# EAGLE board BusPirate-ultra.v1.0b (EAGLE 9.1.3)
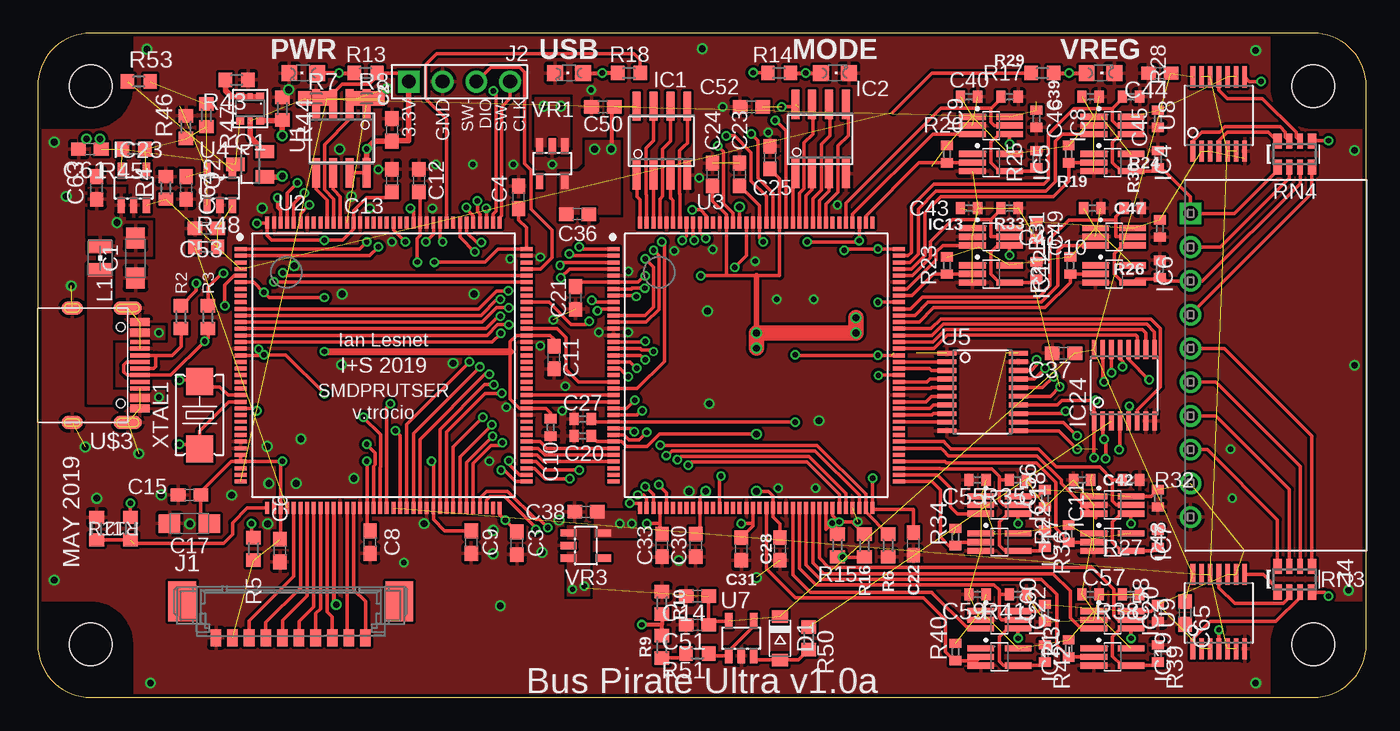
[diagram p2: board, top side]
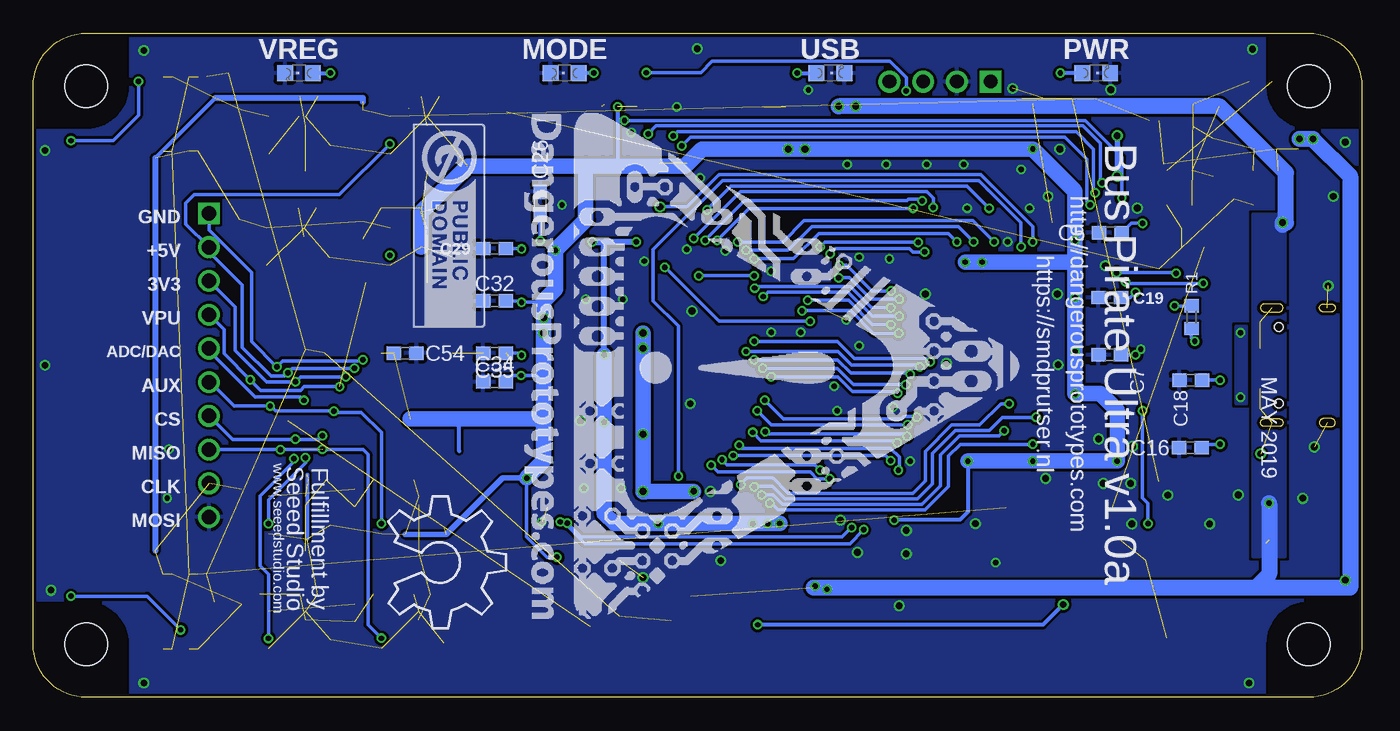
[diagram p3: board, bottom side, seen from below]

Size 100 x 50 mm. Coordinates in mm from the lower left corner, seen from the top.
Copper layers (1*16): Top 0.035mm / dielectric 1.5mm / Bottom 0.035mm
Design rules "dirt_cheap_dirty_boards.v1.1": minimum track width 6mil, minimum drill 12mil, track to track 6mil, track to pad 6mil, pad to pad 6mil, via to via 6mil, smd to smd 0mil, copper to edge 10mil, drill to drill 10mil, minimum pad ring 10mil, minimum via ring 6mil, stop-mask expansion 2mil, vias tented up to drill 25mil, thermal gap 10mil

## Footprints (pad centres in the part's own frame; a part is rotated, then mirrored left to right if it is on the bottom)
SMC_A = smd 1.6 x 1.4: + -1.5,0; - 1.5,0
C0603 = smd 1.1 x 1: 1 -0.85,0; 2 0.85,0
C402 = smd 0.7 x 0.9: 1 -0.65,0; 2 0.65,0
C0402 = smd 0.7 x 0.9: 1 -0.65,0; 2 0.65,0
C603 = smd 1.1 x 1: 1 -0.85,0; 2 0.85,0
SOD-123 = smd 0.91 x 1.22: A 1.635,0; C -1.635,0
SOIC-8 = smd 0.6 x 2.2: 1 -1.905,-2.6; 2 -0.635,-2.6; 3 0.635,-2.6; 4 1.905,-2.6; 5 1.905,2.6; 6 0.635,2.6; 7 -0.635,2.6; 8 -1.905,2.6
SC-70-5_EXTENDED_PADS = smd 0.47 x 2: 1 -0.65,-1.4; 2 0,-1.4; 3 0.65,-1.4; 4 0.65,1.4; 5 -0.65,1.4
SC-70-6_EXTENDED_PADS = smd 0.47 x 2: 1 -0.65,-1.4; 2 0,-1.4; 3 0.65,-1.4; 4 0.65,1.4; 5 0,1.4; 6 -0.65,1.4
SOT-23-5 = smd 0.55 x 1.2: 1 -0.95,-1.3; 2 0,-1.3; 3 0.95,-1.3; 4 0.95,1.3; 5 -0.95,1.3
TSSOP-16 = smd 0.35 x 1.43: 1 -2.275,-2.7; 2 -1.625,-2.7; 3 -0.975,-2.7; 4 -0.325,-2.7; 5 0.325,-2.7; 6 0.975,-2.7; 7 1.625,-2.7; 8 2.275,-2.7; 9 2.275,2.7; 10 1.625,2.7; 11 0.975,2.7; 12 0.325,2.7; 13 -0.325,2.7; 14 -0.975,2.7; 15 -1.625,2.7; 16 -2.275,2.7
MOLEX_533980771 = smd 2.1 x 3: B1 -8.175,1.513; B2 8.175,1.513 | smd 0.8 x 1.3: P1 5.625,-1.238; P2 4.375,-1.238; P3 3.125,-1.238; P4 1.875,-1.238; P5 0.625,-1.238; P6 -0.625,-1.238; P7 -1.875,-1.238; P8 -3.125,-1.238; P9 -4.375,-1.238; P10 -5.625,-1.238
M1X4 = drill 1.02 pad 1.632 square: 1 0,0 | drill 1.02 pad 1.632: 2 2.54,0; 3 5.08,0; 4 7.62,0
M1X10_MALE_RIGHT_ANGLES_PTH_SHROUDED = drill 1.09 square: 1 -11.43,-6.415 | drill 1.09: 2 -8.89,-6.415; 3 -6.35,-6.415; 4 -3.81,-6.415; 5 -1.27,-6.415; 6 1.27,-6.415; 7 3.81,-6.415; 8 6.35,-6.415; 9 8.89,-6.415; 10 11.43,-6.415
WE-KI_0805_B = smd 1.02 x 1.78: 1 -0.89,0; 2 0.89,0
LED-805 = smd 1.2 x 1.2: A 0,-1.05; C 0,1.05
DP10050_V1 = hole 3.2: 4,4; 96,4; 96,46; 4,46
SOT-363 = smd 0.6 x 0.6: 1 -0.75,-0.9; 3 0.75,-0.9; 4 0.75,0.9; 6 -0.75,0.9 | smd 0.4 x 0.5: 2 0,-0.9; 5 0,0.9
SOT-23 = smd 1 x 1.4: 1 -0.95,-1.1; 2 0.95,-1.1; 3 0,1.1
R0603 = smd 1 x 1.1: 1 -0.85,0; 2 0.85,0
R603 = smd 1 x 1.1: 1 -0.85,0; 2 0.85,0
R0402 = smd 0.7 x 0.9: 1 -0.65,0; 2 0.65,0
RN8P-4R-CRA06S = smd 0.63 x 1.15: 1 -1.295,-0.975; 4 1.295,-0.975; 5 1.295,0.975; 8 -1.295,0.975 | smd 0.44 x 1.15: 2 -0.4,-0.975; 3 0.4,-0.975; 6 0.4,0.975; 7 -0.4,0.975
TQFP-144 = smd 0.9 x 0.3: 1 -10.75,8.75; 2 -10.75,8.25; 3 -10.75,7.75; 4 -10.75,7.25; 5 -10.75,6.75; 6 -10.75,6.25; 7 -10.75,5.75; 8 -10.75,5.25; 9 -10.75,4.75; 10 -10.75,4.25; 11 -10.75,3.75; 12 -10.75,3.25; 13 -10.75,2.75; 14 -10.75,2.25; 15 -10.75,1.75; 16 -10.75,1.25; 17 -10.75,0.75; 18 -10.75,0.25; 19 -10.75,-0.25; 20 -10.75,-0.75; 21 -10.75,-1.25; 22 -10.75,-1.75; 23 -10.75,-2.25; 24 -10.75,-2.75; 25 -10.75,-3.25; 26 -10.75,-3.75; 27 -10.75,-4.25; 28 -10.75,-4.75; 29 -10.75,-5.25; 30 -10.75,-5.75; 31 -10.75,-6.25; 32 -10.75,-6.75; 33 -10.75,-7.25; 34 -10.75,-7.75; 35 -10.75,-8.25; 36 -10.75,-8.75; 73 10.75,-8.75; 74 10.75,-8.25; 75 10.75,-7.75; 76 10.75,-7.25; 77 10.75,-6.75; 78 10.75,-6.25; 79 10.75,-5.75; 80 10.75,-5.25; 81 10.75,-4.75; 82 10.75,-4.25; 83 10.75,-3.75; 84 10.75,-3.25; 85 10.75,-2.75; 86 10.75,-2.25; 87 10.75,-1.75; 88 10.75,-1.25; 89 10.75,-0.75; 90 10.75,-0.25; 91 10.75,0.25; 92 10.75,0.75; 93 10.75,1.25; 94 10.75,1.75; 95 10.75,2.25; 96 10.75,2.75; 97 10.75,3.25; 98 10.75,3.75; 99 10.75,4.25; 100 10.75,4.75; 101 10.75,5.25; 102 10.75,5.75; 103 10.75,6.25; 104 10.75,6.75; 105 10.75,7.25; 106 10.75,7.75; 107 10.75,8.25; 108 10.75,8.75 | smd 0.3 x 0.9: 37 -8.75,-10.75; 38 -8.25,-10.75; 39 -7.75,-10.75; 40 -7.25,-10.75; 41 -6.75,-10.75; 42 -6.25,-10.75; 43 -5.75,-10.75; 44 -5.25,-10.75; 45 -4.75,-10.75; 46 -4.25,-10.75; 47 -3.75,-10.75; 48 -3.25,-10.75; 49 -2.75,-10.75; 50 -2.25,-10.75; 51 -1.75,-10.75; 52 -1.25,-10.75; 53 -0.75,-10.75; 54 -0.25,-10.75; 55 0.25,-10.75; 56 0.75,-10.75; 57 1.25,-10.75; 58 1.75,-10.75; 59 2.25,-10.75; 60 2.75,-10.75; 61 3.25,-10.75; 62 3.75,-10.75; 63 4.25,-10.75; 64 4.75,-10.75; 65 5.25,-10.75; 66 5.75,-10.75; 67 6.25,-10.75; 68 6.75,-10.75; 69 7.25,-10.75; 70 7.75,-10.75; 71 8.25,-10.75; 72 8.75,-10.75; 109 8.75,10.75; 110 8.25,10.75; 111 7.75,10.75; 112 7.25,10.75; 113 6.75,10.75; 114 6.25,10.75; 115 5.75,10.75; 116 5.25,10.75; 117 4.75,10.75; 118 4.25,10.75; 119 3.75,10.75; 120 3.25,10.75; 121 2.75,10.75; 122 2.25,10.75; 123 1.75,10.75; 124 1.25,10.75; 125 0.75,10.75; 126 0.25,10.75; 127 -0.25,10.75; 128 -0.75,10.75; 129 -1.25,10.75; 130 -1.75,10.75; 131 -2.25,10.75; 132 -2.75,10.75; 133 -3.25,10.75; 134 -3.75,10.75; 135 -4.25,10.75; 136 -4.75,10.75; 137 -5.25,10.75; 138 -5.75,10.75; 139 -6.25,10.75; 140 -6.75,10.75; 141 -7.25,10.75; 142 -7.75,10.75; 143 -8.25,10.75; 144 -8.75,10.75
TSSOP-20 = smd 0.35 x 1.43: 1 -2.925,-2.7; 2 -2.275,-2.7; 3 -1.625,-2.7; 4 -0.975,-2.7; 5 -0.325,-2.7; 6 0.325,-2.7; 7 0.975,-2.7; 8 1.625,-2.7; 9 2.275,-2.7; 10 2.925,-2.7; 11 2.925,2.7; 12 2.275,2.7; 13 1.625,2.7; 14 0.975,2.7; 15 0.325,2.7; 16 -0.325,2.7; 17 -0.975,2.7; 18 -1.625,2.7; 19 -2.275,2.7; 20 -2.925,2.7
TSSOP-14 = smd 0.35 x 1.6: 1 -1.95,-2.7; 2 -1.3,-2.7; 3 -0.65,-2.7; 4 0,-2.7; 5 0.65,-2.7; 6 1.3,-2.7; 7 1.95,-2.7; 8 1.95,2.9; 9 1.3,2.9; 10 0.65,2.9; 11 0,2.9; 12 -0.65,2.9; 13 -1.3,2.9; 14 -1.95,2.9
C-31-M-12 = smd 0.3 x 1.45: CC1 -1.25,3.005; CC2 1.75,3.005; DN1 0.25,3.005; DN2 -0.75,3.005; DP1 -0.25,3.005; DP2 0.75,3.005; SBU1 1.25,3.005; SBU2 -1.75,3.005 | smd 0.6 x 1.45: GND@1 -3.25,3.005; GND@2 3.25,3.005; VBUS@1 -2.45,3.005; VBUS@2 2.45,3.005 | smd 1 x 2.1: P$1 4.32,2.09; P$2 -4.32,2.09 | smd 1 x 1.6: P$3 -4.32,-2.09; P$4 4.32,-2.09 | hole 0.65: 2.89,1.56; -2.89,1.56
SOT-23-5@1 = smd 0.55 x 1.2: 1 -0.95,-1.3; 2 0,-1.3; 3 0.95,-1.3; 4 0.95,1.3; 5 -0.95,1.3
XTAL_4X6 = smd 2.032 x 2.032: 1 -2.54,0; 2 2.54,0

## Placement (x,y rotation side)
C1  10uF  [SMC_A]  7.37,33.07 270 top
C2  0.1uF  [C0603]  26.67,42.72 270 top
C3  0.1uF  [C0603]  36.07,11.61 90 top
C4  0.1uF  [C0603]  36.2,37.64 270 top
C5  0.1uF  [C0603]  18.92,34.97 0 bottom
C6  0.1uF  [C0603]  18.24,11.05 90 top
C7  0.1uF  [C0603]  18.97,25.78 0 bottom
C8  0.1uF  [C0603]  25.02,11.68 90 top
C9  0.1uF  [C0603]  32.64,11.68 90 top
C10  0.1uF  [C402]  38.61,20.32 270 top
C11  0.1uF  [C0603]  38.86,25.57 90 top
C12  0.1uF  [C0603]  28.7,38.91 270 top
C13  0.1uF  [C0603]  26.67,38.91 270 top
C14  0.1uF  [C0603]  49.66,7.62 180 top
C15  0.1uF  [C0603]  11.43,15.24 0 top
C16  22pF  [C0603]  12.91,18.8 0 bottom
C17  1uF  [SMC_A]  11.43,13.08 180 top
C18  22pF  [C0603]  12.88,23.88 0 bottom
C19  0.1uF  [C0603]  18.97,30.1 0 bottom
C20  0.1uF  [C402]  41.02,19.68 180 top
C21  0.1uF  [C0603]  40.49,30.07 90 top
C22  0.1uF  [C0603]  65.91,11.56 90 top
C23  0.1uF  [C0603]  52.83,39.37 270 top
C24  0.1uF  [C0603]  50.8,39.37 270 top
C25  0.1uF  [C0603]  55.12,40.64 270 top
C26  0.1uF  [C0603]  61.85,37.21 270 bottom
C27  0.1uF  [C402]  41.02,20.95 180 top
C28  0.1uF  [C0603]  55.88,11.18 90 top
C29  0.1uF  [C0603]  65.28,33.78 0 bottom
C30  0.1uF  [C0603]  49.53,11.43 90 top
C31  0.1uF  [C0603]  52.96,11.18 90 top
C32  0.1uF  [C0603]  65.28,29.84 0 bottom
C33  0.1uF  [C0603]  46.99,11.43 90 top
C34  0.1uF  [C0603]  65.28,23.75 0 bottom
C35  0.1uF  [C0603]  65.28,25.91 0 bottom
C36  1uf  [C0603]  40.64,36.37 0 top
C37  0.1uF  [C0603]  77.22,25.91 180 top
C38  1uf  [C0603]  41.27,13.97 180 top
C39  0.1uF  [C0402]  79.25,45.21 0 top
C40  0.1uF  [C0402]  70.1,45.21 0 top
C41  0.1uF  [C0402]  79.38,36.83 0 top
C42  0.1uF  [C0402]  78.61,16.38 180 top
C43  0.1uF  [C0402]  70.1,36.83 0 top
C44  0.1uF  [C0603]  84.45,46.99 180 top
C45  0.1uF  [C0402]  84.33,43.56 90 top
C46  0.1uF  [C0402]  75.18,43.56 90 top
C47  0.1uF  [C0402]  84.45,35.31 90 top
C48  0.1uF  [C0402]  84.33,14.99 90 top
C49  0.1uF  [C0402]  75.18,35.18 90 top
C50  0.1uF  [C0603]  42.55,44.45 180 top
C51  1uF  [C0603]  49.66,5.46 180 top
C52  0.1uF  [C0603]  53.72,44.45 180 top
C53  [C603]  12.7,35.31 180 top
C54  0.1uF  [C0603]  72.01,25.91 0 bottom
C55  0.1uF  [C0402]  70.74,16.38 180 top
C56  0.1uF  [C0402]  75.82,14.99 90 top
C57  0.1uF  [C0402]  79.25,7.75 0 top
C58  0.1uF  [C0402]  84.33,6.35 90 top
C59  0.1uF  [C0402]  70.74,7.75 180 top
C60  0.1uF  [C0402]  75.82,6.35 90 top
C61  1uF  [C603]  3.94,41.27 180 top
C63  10uF  [C603]  4.45,38.35 90 top
C64  0.1uF  [C603]  11.18,38.35 270 top
C65  0.1uF  [C0603]  86.36,6.35 270 top
D1  [SOD-123]  55.88,4.45 270 top
IC1  23LC1024  [SOIC-8]  46.99,41.91 0 top
IC2  23LC1024  [SOIC-8]  58.93,42.04 0 top
IC4  74LVC1G07DBV  [SC-70-5_EXTENDED_PADS]  80.9,40.26 270 top
IC5  74LVC1G07DBV  [SC-70-5_EXTENDED_PADS]  71.75,40.26 270 top
IC6  74LVC1G07DBV  [SC-70-5_EXTENDED_PADS]  81.03,31.88 270 top
IC7  74LVC1G07DBV  [SC-70-5_EXTENDED_PADS]  80.9,11.68 270 top
IC8  SN74LVC1T45DBV  [SC-70-6_EXTENDED_PADS]  80.9,43.05 270 top
IC9  SN74LVC1T45DBV  [SC-70-6_EXTENDED_PADS]  71.75,43.05 270 top
IC10  SN74LVC1T45DBV  [SC-70-6_EXTENDED_PADS]  81.03,34.67 270 top
IC11  SN74LVC1T45DBV  [SC-70-6_EXTENDED_PADS]  80.9,14.48 270 top
IC12  74LVC1G07DBV  [SC-70-5_EXTENDED_PADS]  71.75,31.88 270 top
IC13  SN74LVC1T45DBV  [SC-70-6_EXTENDED_PADS]  71.75,34.67 270 top
IC17  74LVC1G07DBV  [SC-70-5_EXTENDED_PADS]  72.39,11.68 270 top
IC18  SN74LVC1T45DBV  [SC-70-6_EXTENDED_PADS]  72.39,14.48 270 top
IC19  74LVC1G07DBV  [SC-70-5_EXTENDED_PADS]  80.9,3.05 270 top
IC20  SN74LVC1T45DBV  [SC-70-6_EXTENDED_PADS]  80.9,5.84 270 top
IC21  74LVC1G07DBV  [SC-70-5_EXTENDED_PADS]  72.39,3.05 270 top
IC22  SN74LVC1T45DBV  [SC-70-6_EXTENDED_PADS]  72.39,5.84 270 top
IC23  MCP1824_ADJ  [SOT-23-5]  7.24,38.35 0 top
IC24  74HCT4051  [TSSOP-16]  81.79,23.5 0 top
J1  CON_MOLEX_MALE_SMT_SH_1.25  [MOLEX_533980771]  19.05,5.71 0 top
J2  CON_HEADER_1X04  [M1X4]  27.94,46.35 0 top
J4  CON_HEADER_1X10-RIGHT_ANGLED_PTH_SHROUDED  [M1X10_MALE_RIGHT_ANGLES_PTH_SHROUDED]  93.19,25 270 top
L1  1.5A  [WE-KI_0805_B]  4.7,33.07 270 top
LED1  Optional YELLOW  [LED-805]  20,47 270 bottom
LED2  YELLOW  [LED-805]  20,47 90 top
LED3  YELLOW  [LED-805]  60,47 270 top
LED4  Optional YELLOW  [LED-805]  60,47 90 bottom
LED5  YELLOW  [LED-805]  80,47 270 top
LED6  Optional YELLOW  [LED-805]  80,47 90 bottom
LED7  YELLOW  [LED-805]  40,47 90 top
LED8  Optional YELLOW  [LED-805]  40,47 270 bottom
LOGO1  LOGO_CC-0  [LOGO_CC-0]  71.37,43.18 270 bottom
PCB1  PCB_DP_RECTANGLE-50X100  [DP10050_V1]  0,0 0 top
Q1  DMMT3906W  [SOT-363]  16,44.32 180 top
Q2  [SOT-23]  16,40.13 90 top
R1  1.5K  [R0603]  12.83,28.62 90 bottom
R2  22R  [R0603]  10.79,28.62 270 top
R3  22R  [R0603]  12.83,28.62 270 top
R4  10K  [R603]  9.65,38.35 90 top
R5  10K  [R603]  16.26,11.18 270 top
R6  10K  [R603]  64.01,11.43 270 top
R7  10K  [R0603]  20.95,45.09 0 top
R8  10K  [R0603]  24.77,45.09 0 top
R9  10K  [R0603]  46.99,3.81 90 top
R10  10K  [R0603]  46.99,7.11 270 top
R11  10K  [R0603]  6.99,12.7 270 top
R12  10K  [R0603]  4.45,12.7 270 top
R13  1K1  [R603]  24.7,47 0 top
R14  1K1  [R603]  55.81,47 180 top
R15  10K  [R0603]  60.2,11.43 270 top
R16  10K  [R0603]  62.23,11.43 270 top
R17  1K1  [R603]  75.62,47 180 top
R18  1K1  [R603]  44.51,47 0 top
R19  100K  [R0402]  77.6,40.89 90 top
R20  100K  [R0402]  68.45,40.89 90 top
R21  100K  [R0402]  77.72,32.51 90 top
R22  100K  [R0402]  77.6,12.32 90 top
R23  100K  [R0402]  68.45,32.51 90 top
R24  1M  [R0402]  84.33,40.51 270 top
R25  1M  [R0402]  75.18,40.51 270 top
R26  1M  [R0402]  84.45,32.26 270 top
R27  1M  [R0402]  84.33,11.94 270 top
R28  100K  [R0402]  82.3,45.21 180 top
R29  100K  [R0402]  73.15,45.21 180 top
R30  100K  [R0402]  82.42,36.83 180 top
R31  1M  [R0402]  75.18,32.13 270 top
R32  100K  [R0402]  82.3,16.38 180 top
R33  100K  [R0402]  73.15,36.83 180 top
R34  100K  [R0402]  69.09,12.06 90 top
R35  100K  [R0402]  73.79,16.38 180 top
R36  1M  [R0402]  75.82,11.94 270 top
R37  100K  [R0402]  77.6,3.68 90 top
R38  100K  [R0402]  82.3,7.75 180 top
R39  1M  [R0402]  84.33,3.3 270 top
R40  100K  [R0402]  69.09,3.41 90 top
R41  100K  [R0402]  73.79,7.75 180 top
R42  1M  [R0402]  75.82,3.3 270 top
R43  [R603]  14.99,46.48 180 top
R44  [R603]  18.41,44.32 270 top
R45  100K  [R603]  7.24,41.27 180 top
R46  50K  [R603]  11.18,42.93 90 top
R47  78.7K  [R603]  12.7,43.81 270 top
R48  [R603]  12.7,33.91 0 top
R50  [R0603]  58.04,4.45 270 top
R51  [R0603]  49.66,3.3 180 top
R53  0R  [R603]  7.62,46.35 0 top
RN3  2K  [RN8P-4R-CRA06S]  94.61,8.89 0 top
RN4  2K  [RN8P-4R-CRA06S]  94.61,40.89 0 top
U1  W25X40CL  [SOIC-8]  22.86,42.09 180 top
U2  STM32F103ZX  [TQFP-144]  26.04,25 0 top
U3  ICE40HX4K  [TQFP-144]  54.09,25 0 top
U4  MCP6001  [SOT-23-5]  13.72,38.35 0 top
U5  74LVC245A  [TSSOP-20]  71.12,22.99 270 top
U7  MCP6001  [SOT-23-5]  52.96,4.45 0 top
U8  74HCT4066PW  [TSSOP-14]  88.9,43.81 0 top
U9  74HCT4066PW  [TSSOP-14]  88.9,6.35 0 top
U$1  [DP-LOGO]  61.84,-11.22 0 top  (outside the outline)
U$2  [OSHW_8X350_NOTEXT]  73.28,15.11 270 bottom
U$3  USB-C-12  [C-31-M-12]  4.69,25 270 top
U$4  [DP_LOGO_ART_1.5X1.5]  63.01,43.98 270 bottom
VR1  MCP1801T-3302I/OT  [SOT-23-5@1]  38.73,40.18 180 top
VR3  MCP1801T-1202I/OT  [SOT-23-5@1]  41.27,11.43 270 top
XTAL1  8Mhz  [XTAL_4X6]  12.19,21.26 90 top

## Tracks (layer width: path | path; a pad name or v marks a point on that pad's centre or on a via)
1V2  (via drill 0.41)  (1 unrouted)
  Top 0.254: C33.2 46.84,12.43 U3.40 46.84,13.08 v45.85,13.08 | 53.84,13.08 53.84,12.91 C31.2 | C23.2 54.34,37.01 U3.126 54.34,34.56 v54.61,34.29 | C27.1 41.67,20.75 U3.27 45.26,20.75 56.97,20.75 v57.02,20.7 | 53.84,13.08 v52.96,13.08 | U3.54 53.84,13.08 | U3.92 v63.25,25.75 57.05,25.75 v57.02,25.78 | v57.91,34.29 61.75,34.29 v61.85,34.38 61.84,34.4 U3.111
  Bottom 0.254: 64.26,25.75 64.27,25.75 | C35.2 63.4,25.91 v63.25,25.75 | C26.2 v61.85,34.38
  Bottom 0.457: v57.02,25.78 57.02,34.29 | v57.91,34.29 57.02,34.29 | v54.61,34.29 57.02,34.29
  Bottom 1.168: v43.81,13.08 v45.85,13.08 46.86,13.08 48.26,13.08 v52.96,13.08 56.26,13.08 57.02,13.84 57.02,17.27 v57.02,20.7 v57.02,25.78
  other vias: 44.7,13.08
  pour Top (no thermals): 45.09,13.97 41.91,13.97 41.91,12.06 45.09,12.06
3V3  (via drill 0.41, 0.51)  (40 unrouted)
  Top 0.254: C12.2 28.79,37.98 U2.121 28.79,34.76 28.57,34.55 v28.57,32.77 | C11.2 38.86,26.97 38.58,27.25 U2.95 36.04,27.25 35.56,26.77 35.56,26.04 35.56,22.48 36.29,21.75 U2.84 38.25,21.75 38.61,21.39 C10.1 | C13.2 26.25,37.64 24.77,37.64 23.79,36.66 U2.131 23.79,35.26 22.95,34.42 v21.59,34.42 17.61,34.42 17.29,34.75 17.29,35.31 | C22.2 65.91,14.14 62.94,14.14 U3.72 62.84,16.48 v62.87,16.51 | C8.2 24.79,12.56 U2.52 24.79,17.76 v24.77,17.78 | C30.2 49.84,12.59 U3.46 49.84,15.06 v50.29,15.51 | U2.72 34.78,13.74 | 34.78,13.74 C3.2 | C20.1 42.11,19.25 U3.30 43.96,19.25 44.34,18.88 45.88,18.88 46.81,19.81 v54.1,19.81 | J2.1 27.3,47 R13.2 25.55,46.75 24.97,46.17 22.93,46.17 22.23,45.47 U1.3 | U2.33 14.57,17.75 12.28,15.46 C15.2 12.28,13.73 C17.+ | v60.71,33.66 60.8,33.75 v63.25,33.75 U3.108 65.08,33.75 | v56.01,44.45 57.22,44.45 | U2.33 18.39,17.75 v18.41,17.78 18.29,17.65 U2.39 18.29,11.93 C6.2 | U2.32 U2.33 | v29.65,17.78 29.79,17.64 U2.62 29.79,13.39 30.65,12.53 C9.2 | 34.78,13.74 34.8,13.74 v35.19,13.35 | v29.84,32.77 33.66,32.77 34.65,33.75 U2.108 36.78,35.35 36.2,35.94 C4.2 | U2.144 17.29,35.31 | U2.6 16.27,31.25 v17.03,30.49 17.42,30.1 18.03,30.1 v21.59,30.1 | v45.72,31.75 45.69,31.75 45.19,31.25 U3.6 40.81,31.25 C21.2 | C28.2 55.88,13.04 55.34,13.58 U3.57 55.34,15.15 54.99,15.49 v54.1,15.49 | R16.2 62.19,10.54 v60.58,10.54 60.24,10.54 R15.2 | U3.100 v63.25,29.75 | 51.84,31.75 U3.131 51.84,36.34 50.8,37.38 C24.2 | 51.84,31.75 54.1,31.75 55.84,31.75 U3.123 55.84,39.07 C25.2 | U1.7 U1.8 | v49.91,31.75 51.84,31.75 | 80.01,43.72 IC8.1 | v63.28,24.23 63.55,24.23 63.57,24.25 U3.89
  Top 0.254: U2.17 16.99,25.75 v17.02,25.78 18.67,25.78 v21.59,22.86 | v16.51,35.69 17.29,35.69 17.29,35.31
  Top 0.305: 45.02,44.45 IC1.8 | C50.1 43.18,44.23 v43.18,41.27
  Top 0.406: J2.1 27.94,41.91 26.71,41.91 C2.2 25.36,41.87 v24.77,41.27 U1.8 | v54.1,27.43 54.1,31.75
  Top 0.508: v21.59,26.04 35.56,26.04
  Top 1.168: v54.1,26.29 v54.1,27.43 v61.59,27.43 v61.59,28.57
  Bottom 0.254: v62.87,16.51 62.87,12.06 61.34,10.54 v60.58,10.54 | v45.72,31.75 v49.91,31.75 | C34.2 63.95,24.23 v63.28,24.23 61.7,24.23 61.59,24.13 | 61.59,29.84 61.69,29.75 v63.25,29.75 63.34,29.84 C32.2 | C29.2 63.28,33.78 v63.25,33.75 | C7.2 v17.02,25.78 | C19.2 17.42,30.1 v17.03,30.49 | C5.2 17.36,35.69 v16.51,35.69
  Bottom 0.305: 67.94,18.54 67.94,20.95 | 79.38,16.76 79.38,11.94 | v56.01,44.45 56.01,40.01 | v29.65,17.78 29.65,13.97 30.21,13.41 35.13,13.41 v35.19,13.35
  Bottom 0.406: v62.87,16.51 64.67,16.51 68.92,12.27 72.01,12.27
  Bottom 1.168: 61.59,20.95 61.59,24.13 v61.59,28.57 61.59,29.84 60.71,30.73 v60.71,33.66 58.42,35.94 58.42,40.01 | 61.59,20.95 61.59,17.78 v62.87,16.51 | 70.79,33.91 70.79,36.52 67.31,40.01 66.17,40.01 61.59,40.01 58.42,40.01 | 61.59,20.95 67.94,20.95 71.63,20.95 | v29.65,17.78 v24.77,17.78 v18.41,17.78 18.41,21.59 19.68,22.86 v21.59,22.86 v21.59,26.04 v21.59,30.1 21.59,32.77 | 21.59,32.77 v21.59,34.42 21.59,38.1 v24.77,41.27 v41.91,41.27 49.66,41.27 50.93,40.01 56.01,40.01 56.52,40.01 57.15,40.01 | 21.59,32.77 v28.57,32.77 v29.84,32.77 | v50.29,15.51 50.29,15.49 53.98,15.49 | v54.1,27.43 v54.1,19.81 v54.1,15.49 | 58.42,40.01 57.15,40.01 | 57.15,40.01 55.24,40.01
  Bottom 1.219: v54.1,15.49 53.98,15.49
  pour Top (no thermals): 39.37,39.55 40.81,39.55 41.27,40.01 41.27,41.91 43.81,41.91 43.81,36.37 39.37,36.37
ADC1  (via drill 0.41, 0.51)
  Top 0.305: U2.47 22.29,7.18 v22.48,6.99 | 46.99,5.46 v45.47,5.46 | R9.2 46.99,5.46 | R10.2 46.99,5.46
  Bottom 0.305: v22.48,6.99 24,5.46 v45.47,5.46
ADC_MUX_EN
  Top 0.254: IC24.6 82.76,21.63 84.52,23.38 84.52,27.76 83.78,28.5 67.99,28.5 67.25,27.75 U3.96
ADC_MUX_S0
  Top 0.254: IC24.11 82.76,27.18 82.67,27.27 68.49,27.27 67.47,26.25 U3.93
ADC_MUX_S1
  Top 0.254: U3.94 67.4,26.75 68.33,27.68 83.16,27.68 83.41,27.43 IC24.10
ADC_MUX_S2
  Top 0.254: IC24.9 84.06,27.51 83.48,28.09 68.16,28.09 67.32,27.25 U3.95
BPIO0  (via drill 0.41)
  Top 0.254: U5.18 74.78,24.61 75.18,25.02 v75.18,25.4 | 84.07,39.61 IC4.4 81.55,39.61 80.9,40.26 80.9,41.78 81.53,42.42 81.55,42.4 IC8.4 | 84.07,39.61 R24.2 | 84.07,39.61 84.85,39.61 86.77,37.69 J4.1 90.08,36.43 93.32,39.66 RN4.1 | v81.67,24.88 81.67,25.27 81.46,25.48 IC24.13
  Bottom 0.254: J4.1 86.77,35.19 83.57,31.98 83.57,26.78 v81.67,24.88 81.67,24.9 81.24,25.34 75.25,25.34 v75.18,25.4
BPIO1  (via drill 0.41)
  Top 0.254: IC9.4 72.9,42.4 | J4.2 89.01,33.89 94.22,39.1 RN4.2 | U5.17 75.02,23.96 v75.82,24.77 | IC9.4 72.38,42.4 71.75,41.78 71.75,40.26 72.41,39.61 IC5.4 74.93,39.61 R25.2 | v80.83,24.45 80.81,24.47 IC24.14 | IC9.4 v73.16,41.66 v73.15,41.66
  Bottom 0.254: 75.69,24.64 v75.82,24.77 80.52,24.77 v80.83,24.45 81.09,24.19 82.11,24.19 84.26,26.35 84.26,31.02 86.77,33.53 J4.2 88.52,35.64 88.52,37.21 87.88,37.85 76.96,37.85 v73.15,41.66
BPIO2  (via drill 0.41)
  Top 0.254: RN4.3 95.02,38.69 87.67,31.35 J4.3 84.97,31.35 84.84,31.48 | U5.16 75.64,23.31 v76.45,24.13 | IC24.15 80.16,23.85 v80.26,23.75 | 84.84,31.48 84.71,31.61 R26.2 | 84.84,31.48 82.68,31.48 IC6.4 81.68,31.23 81.03,31.88 81.03,33.4 81.65,34.02 IC10.4
  Bottom 0.254: J4.3 84.8,29.38 84.8,26.12 82.42,23.75 v80.26,23.75 79.88,24.13 v76.45,24.13
BPIO3  (via drill 0.41)  (1 unrouted)
  Top 0.254: J4.4 95.91,37.95 RN4.4 | U5.15 76.21,22.66 v76.94,23.39 | v73.15,33.27 v73.16,33.28 IC13.4 72.25,34.02 71.75,33.53 71.75,31.88 72.41,31.23 IC12.4 74.93,31.23 R31.2 | IC24.12 82.11,25.43 83.65,23.9 v83.67,23.9
  Bottom 0.254: v76.94,23.39 79.6,23.39 79.87,23.11 82.88,23.11 v83.67,23.9 85.64,25.87 85.64,27.68 J4.4
BPIO4  (via drill 0.41)
  Top 0.254: RN3.5 95.91,19.66 89.3,26.27 J4.5 | R27.2 84.2,11.29 83.95,11.03 IC7.4 81.55,11.03 80.9,11.68 80.9,13.21 81.52,13.83 IC11.4 v82.3,13.08 | U5.14 76.75,22.01 77.09,22.35 v79.63,22.35 79.51,22.24 IC24.1 79.51,19.83 79.51,18.05 v79.5,18.03
  Bottom 0.254: v82.3,13.08 82.3,14.86 79.5,17.65 v79.5,18.03 | v79.63,22.35 79.88,22.61 83.31,22.61 86.77,26.06 J4.5
BPIO5  (via drill 0.41)
  Top 0.254: RN3.6 95.02,17.38 88.67,23.73 J4.6 | R36.2 75.56,11.03 IC17.4 72.79,11.03 72.39,11.43 72.39,13.21 73.01,13.83 IC18.4 v73.79,13.08 | U5.13 76.87,21.36 77.19,21.36 v77.38,21.55 | v82.17,21.93 82.11,21.88 IC24.5
  Bottom 0.254: v73.79,13.08 73.79,19.94 75.31,21.46 77.29,21.46 v77.38,21.55 81.76,21.55 82.14,21.93 v82.17,21.93 84.88,21.93 86.67,23.73 J4.6
BPIO6  (via drill 0.41)
  Top 0.254: 81.55,2.4 IC19.4 | 86.74,21.22 J4.7 88.67,21.19 94.22,15.64 RN3.7 | IC19.4 81.59,2.4 80.89,3.09 80.89,4.56 81.53,5.19 IC20.4 v82.3,4.44 | IC19.4 84.07,2.4 R39.2 | U5.12 77.2,20.71 v78.23,19.68 | IC24.2 80.16,19.33 v80.26,19.43 80.39,19.3 v80.39,17.97
  Bottom 0.254: v82.3,4.44 82.3,9.26 82.93,9.9 82.93,15.18 80.39,17.72 v80.39,17.97 | J4.7 84.99,19.41 80.28,19.41 v80.26,19.43 78.49,19.43 v78.23,19.68
BPIO7  (via drill 0.41)  (1 unrouted)
  Top 0.254: RN3.8 93.32,13.36 88.03,18.65 J4.8 | R42.2 75.69,2.65 75.44,2.4 IC21.4 72.7,2.4 72.39,2.71 72.39,4.57 73.01,5.19 IC22.4 v73.79,4.45 | IC24.4 81.46,18.71 v81.41,18.65 | U5.11 76.87,20.06 v78.23,18.7 v78.23,18.69
  Bottom 0.254: J4.8 v81.41,18.65 79.78,18.65 79.77,18.67 75.18,18.67 74.8,18.29 74.8,5.46 v73.79,4.45
BUFDIR0
  Top 0.254: R28.2 81.65,45.07 80.9,44.32 | IC8.5 81.28,43.05 80.9,43.43 80.9,44.32 | 80.9,44.32 77.98,44.32 76.07,42.42 76.07,38.99 75.72,38.63 67.46,38.63 65.75,36.93 65.75,33.49 65.51,33.25 U3.107
BUFDIR1  (1 unrouted)
  Top 0.254: R29.2 72.5,45.07 71.75,44.32 | IC9.5 72.01,43.05 71.75,43.31 71.75,44.36 67.98,44.36 60.84,37.22 U3.113
BUFDIR2
  Top 0.254: IC10.5 81.15,34.67 81.15,35.56 | R30.2 81.15,36.2 81.15,36.07 81.15,35.56 | U3.99 65.7,29.25 66.6,30.15 75.37,30.15 76.2,30.99 76.2,34.54 77.6,35.94 81.15,35.94 81.15,35.56
BUFDIR3
  Top 0.254: 73.97,34.67 IC13.5 71.75,34.67 71.75,35.97 | 72.39,36.83 R33.2 72.5,36.72 71.75,35.97 | 71.75,35.97 68.86,35.97 67.2,34.31 67.2,33.11 65.84,31.75 U3.104
BUFDIR4
  Top 0.254: 80.9,16.38 79.95,17.34 76.69,17.34 75.31,18.72 68.73,18.72 68.36,19.09 68.2,19.25 U3.79 | 80.9,16.38 80.9,14.77 81.19,14.48 IC11.5 | R32.2 80.9,16.38
BUFDIR5
  Top 0.254: 73.91,14.48 IC18.5 72.68,14.48 72.38,14.78 72.38,16.38 | 72.38,16.38 72.38,16.64 71.82,17.21 67.95,17.21 67.91,17.25 U3.75 | R35.2 72.38,16.38
BUFDIR6
  Top 0.254: 81.02,7.75 81.02,8.13 79.35,9.8 59.53,9.8 58.84,10.49 U3.64 | IC20.5 81.32,5.84 81.02,6.14 81.02,7.75 | R38.2 81.03,7.75 81.02,7.75
BUFDIR7
  Top 0.254: IC22.5 72.56,5.84 72.38,6.01 72.38,7.75 | R41.2 72.38,7.75 | 72.38,7.75 72.38,8.07 71.98,8.48 67.59,8.48 58.58,8.48 57.34,9.72 U3.61
BUFIO0
  Top 0.254: IC8.3 77.13,42.4 76.61,41.88 76.61,38.83 75.89,38.1 67.62,38.1 66.28,36.76 66.28,33.37 65.67,32.75 U3.106
BUFIO1
  Top 0.254: IC9.3 67.38,42.4 61.34,36.36 U3.112
BUFIO2
  Top 0.254: IC10.3 77.2,34.02 76.8,33.62 76.8,31.02 75.53,29.75 67.03,29.75 66.03,28.75 U3.98
BUFIO3
  Top 0.254: 69.5,34.02 IC13.3 68.12,34.02 67.61,33.51 67.61,32.94 65.42,30.75 U3.102
BUFIO4
  Top 0.254: IC11.3 79.64,13.69 79.64,13.52 77.06,16.09 77.06,16.35 75.21,18.19 68.56,18.19 68.14,18.61 68,18.75 U3.78
BUFIO5
  Top 0.254: IC18.3 69.23,13.83 68.71,14.35 68.71,15.77 67.89,16.58 67.72,16.75 U3.74
BUFIO6
  Top 0.254: IC20.3 78.52,5.19 77.72,6 77.72,8.01 76.43,9.3 59.18,9.3 58.34,10.14 U3.63
BUFIO7
  Top 0.254: IC22.3 70.01,5.19 67.32,7.88 67.3,7.9 58.17,7.9 56.84,9.23 U3.60
BUFOD0
  Top 0.254: IC4.2 78.5,40.26 77.86,40.26 77.6,40.26 R19.1 77.6,38.85 76.44,37.69 67.98,37.69 66.79,36.51 66.79,33.27 65.77,32.25 U3.105
BUFOD1
  Top 0.254: IC5.2 70.34,40.24 R20.1 | 68.43,40.24 R20.1 | R20.1 66.34,40.24 62.34,36.24 U3.110
BUFOD2
  Top 0.254: IC6.2 79.63,31.86 R21.1 77.72,31.23 75.82,29.33 67.44,29.33 66.35,28.25 U3.97
BUFOD3
  Top 0.254: 69.78,31.86 70.36,31.86 IC12.2 68.71,31.88 | 68.71,31.88 68.47,31.88 R23.1 | U3.101 65.81,30.25 67.44,31.88 68.71,31.88
BUFOD4
  Top 0.254: IC7.2 77.6,11.68 R22.1 77.6,11.77 76.65,12.72 76.65,16.18 75.18,17.65 68.4,17.65 68.3,17.75 U3.76
BUFOD5
  Top 0.254: IC17.2 69.09,11.68 R34.1 68.59,11.41 67.94,12.06 67.94,15.62 67.44,16.13 67.32,16.25 U3.73
BUFOD6
  Top 0.254: IC19.2 79.5,3.03 R37.1 76.71,3.92 76.71,7.75 75.56,8.89 58.93,8.89 57.84,9.98 U3.62
BUFOD7
  Top 0.254: IC21.2 70.71,2.76 R40.1 68.99,2.76 68.33,3.43 68.33,5.84 66.67,7.49 57.02,7.49 54.84,9.68 U3.56
D+  (via drill 0.41)
  Top 0.254: U$3.DP1 6.71,25.25 6.48,25.02 6.48,24.51 6.74,24.25 U$3.DP2 10.03,24.25 v12.57,26.8 12.83,27.05 R3.2
  Bottom 0.254: R3.2 12.83,27.05 v12.57,26.8
D-
  Top 0.254: U$3.DN1 8.75,24.75 8.89,24.89 8.89,25.75 | R2.2 10.79,26.42 10.13,25.75 8.89,25.75 | U$3.DN2 8.89,25.75
DISPLAY_AUX1
  Top 0.254: U2.44 20.79,6.82 19.68,5.71 J1.P5
DISPLAY_AUX2
  Top 0.254: U2.45 21.29,6.68 20.93,6.32 J1.P4
DISPLAY_CS
  Top 0.254: U2.50 23.79,8.1 24.68,7.21 J1.P1
DISPLAY_D/P
  Top 0.254: U2.49 23.29,4.62 J1.P2
DISPLAY_PWM
  Top 0.254: U2.46 21.79,6.46 22.18,6.07 J1.P3
DISPLAY_SPI_CLOCK
  Top 0.254: U2.41 19.29,9.12 15.93,5.76 J1.P8
DISPLAY_SPI_MISO
  Top 0.254: U2.42 19.79,8.26 17.18,5.64 J1.P7
DISPLAY_SPI_MOSI
  Top 0.254: U2.43 20.29,7.66 18.43,5.79 J1.P6
FLASH_CS  (1 unrouted)
FLASH_MISO
  Top 0.254: U2.134 22.29,37.52 21.59,38.21 21.59,41.61 23.5,43.52 U1.2
FLASH_MOSI
  Top 0.254: U2.135 21.79,37.44 21.04,38.19 | 21.04,38.19 20.95,38.27 | 21.04,38.19 20.95,38.27 | 20.95,38.27 U1.5
FLASH_SCK
  Top 0.254: U2.133 22.79,37.72 22.31,38.19 | 22.31,38.19 22.23,38.27 | 22.31,38.19 22.23,38.27 | 22.23,38.27 U1.6
FPGA_CDONE  (via drill 0.41)
  Top 0.254: U3.65 59.34,12.65 v59.79,13.11 60.2,12.7 R15.1 | U2.69 33.28,15 33.81,15.52 35.38,15.52 37.51,13.38 37.79,13.38 v38.4,12.78
  Bottom 0.254: v59.79,13.11 58.75,12.06 39.12,12.06 v38.41,12.78 v38.4,12.78
FPGA_CRESET  (via drill 0.41)
  Top 0.254: U3.66 59.84,13.69 v60.33,13.21 61.3,13.21 R16.1 | U2.70 33.78,14.86 34.04,15.11 35.14,15.11 37.51,12.74 v37.51,12.62
  Bottom 0.254: v60.33,13.21 60.1,13.21 58.45,11.56 38.54,11.56 37.51,12.59 v37.51,12.62
FPGA_PROG_CLOCK  (via drill 0.41)
  Top 0.254: U3.70 61.84,15.22 58.5,18.57 47.75,18.57 47.39,18.21 v47.32,18.21 | U2.74 36.28,16.75 35.46,17.57 v35.46,17.83
  Bottom 0.254: v47.32,18.21 35.84,18.21 v35.46,17.83
FPGA_PROG_CS  (via drill 0.41)
  Top 0.254: R6.1 62.34,13.95 U3.71 62.34,15.3 58.66,18.97 47.62,18.97 v46.87,18.97 | U2.73 35.99,16.25 35.13,17.1 v34.88,17.1
  Bottom 0.254: v46.87,18.97 46.64,18.74 35.48,18.74 34.82,18.09 34.82,17.16 v34.88,17.1
FPGA_PROG_MISO  (via drill 0.41)
  Top 0.254: U2.75 37.41,17.25 38.2,16.46 v40.06,16.46 | U3.67 60.34,15.28 57.89,17.73 49.23,17.73 v48.97,17.47
  Bottom 0.254: v48.97,17.47 48.45,16.95 41.52,16.95 41.02,16.46 v40.06,16.46
FPGA_PROG_MOSI  (via drill 0.41)
  Top 0.254: v40.77,17.11 38.14,17.11 37.51,17.75 U2.76 | U3.68 60.84,15.36 58.06,18.13 48.41,18.13 v48.16,17.88
  Bottom 0.254: v48.16,17.88 47.78,17.5 41.15,17.5 v40.77,17.11
FSMC_A0  (via drill 0.41)
  Top 0.254: U3.3 39.53,32.75 v39.32,32.53 | U2.10 33.19,29.25 34.54,30.6 v35.43,30.6
  Bottom 0.254: v35.43,30.6 36.88,30.6 38.81,32.53 v39.32,32.53
FSMC_A1  (via drill 0.41)
  Top 0.254: v34.82,29.97 34.59,29.97 33.37,28.75 U2.11 | U3.4 40.02,32.25 v39.37,31.59
  Bottom 0.254: v34.82,29.97 36.96,29.97 38.58,31.59 v39.37,31.59
FSMC_A2  (via drill 0.41)
  Top 0.254: v35.46,29.33 34.54,29.33 33.46,28.25 U2.12 | U3.7 44.7,30.75 44.76,30.81 v45.7,30.81
  Bottom 0.254: v35.46,29.33 36.91,29.33 38.51,30.94 45.57,30.94 v45.7,30.81
FSMC_A3  (via drill 0.41)
  Top 0.254: U2.13 33.75,27.75 34.7,28.7 v34.82,28.7 | U3.8 44.98,30.25 v45.06,30.18
  Bottom 0.254: v34.82,28.7 36.85,28.7 38.69,30.53 44.7,30.53 v45.06,30.18
FSMC_A4  (via drill 0.41)
  Top 0.254: U2.14 33.82,27.25 34.63,28.06 v35.45,28.06 v35.46,28.06 | v41.71,29.9 41.85,29.75 U3.9
  Bottom 0.254: v41.71,29.9 38.66,29.9 36.83,28.06 v35.46,28.06
FSMC_A5  (via drill 0.41)
  Top 0.254: v34.87,27.4 34.22,26.75 U2.15 | v42.14,29.11 42.28,29.25 U3.10
  Bottom 0.254: v34.87,27.4 36.75,27.4 38.46,29.11 v42.14,29.11
FSMC_D0
  Top 0.254: U2.85 U3.24
FSMC_D1
  Top 0.254: U2.86 U3.23
FSMC_D2  (via drill 0.41)
  Top 0.254: U3.1 40.93,33.75 v40.77,33.91 | v33.41,34.26 33.03,34.26 32.28,35 U2.114
  Bottom 0.254: v33.41,34.26 40.42,34.26 v40.77,33.91
FSMC_D3  (via drill 0.41)
  Top 0.254: U3.2 40.14,33.25 v40.01,33.38 | U2.115 31.79,34.64 v32.89,33.53
  Bottom 0.254: v32.89,33.53 33.78,33.53 34.04,33.78 39.61,33.78 v40.01,33.38
FSMC_D4  (via drill 0.41)
  Top 0.254: U2.58 27.79,20.53 v32.51,25.25 | v45.72,26.8 45.67,26.75 U3.15
  Bottom 0.254: v45.72,26.8 39.47,26.8 38.2,25.52 32.78,25.52 v32.51,25.25
FSMC_D5  (via drill 0.41)
  Top 0.254: U2.59 28.29,19.87 v33.29,24.87 | v46.35,26.04 46.24,26.15 45.47,26.15 45.37,26.25 U3.16
  Bottom 0.254: v46.35,26.04 39.43,26.04 38.42,25.02 33.44,25.02 v33.29,24.87
FSMC_D6  (via drill 0.41)
  Top 0.254: U2.60 28.79,19.43 33.68,24.33 v33.98,24.33 | U3.17 45.37,25.75 v45.72,25.4
  Bottom 0.254: v33.98,24.33 34.06,24.41 38.47,24.41 39.46,25.4 v45.72,25.4
FSMC_D7  (via drill 0.41)
  Top 0.254: U2.63 30.29,20.17 33.66,23.54 v34.34,23.54 | U3.18 44.6,25.25 v45.09,24.77
  Bottom 0.254: v34.34,23.54 34.37,23.57 38.26,23.57 39.46,24.77 v45.09,24.77
FSMC_D8  (via drill 0.41)
  Top 0.254: v44.45,24.13 44.07,24.51 44.07,24.52 43.83,24.75 U3.19 | U2.64 30.79,19.99 33.68,22.88 v34.92,22.88
  Bottom 0.254: v44.45,24.13 39.45,24.13 38.35,23.04 35.08,23.04 v34.92,22.88
FSMC_D9  (via drill 0.41)
  Top 0.254: v44.95,22.38 44.32,21.75 U3.25 | U2.65 31.29,18.85 v33.51,21.07
  Bottom 0.254: v44.95,22.38 43.52,20.95 34.65,20.95 34.45,21.15 33.58,21.15 v33.51,21.07
FSMC_D10  (via drill 0.41)
  Top 0.254: v45.51,21.57 45.44,21.57 45.12,21.25 U3.26 | U2.66 31.79,18.11 v34.19,20.52
  Bottom 0.254: v34.19,20.52 44.45,20.52 v45.51,21.57
FSMC_D11  (via drill 0.41)
  Top 0.254: v44.91,20 44.66,20.25 U3.28 | U2.67 32.28,17.7 v34.24,19.65
  Bottom 0.254: v34.24,19.65 34.41,19.82 44.74,19.82 v44.91,20
FSMC_D12  (via drill 0.41)
  Top 0.254: U3.29 44.13,19.75 44.52,19.36 45.26,19.36 v45.85,19.94 | U2.68 32.78,17.62 34.12,18.96 34.76,18.96 v34.98,19.17
  Bottom 0.254: v34.98,19.17 35.11,19.31 45.21,19.31 v45.85,19.94
FSMC_D13
  Top 0.254: U2.77 37.59,18.25 38.09,17.75 U3.33
FSMC_D14
  Top 0.254: U2.78 37.67,18.75 38.17,18.25 U3.32
FSMC_D15
  Top 0.254: U3.31 38.3,18.75 37.8,19.25 U2.79
FSMC_NE3_CE  (via drill 0.41)
  Top 0.254: v46.99,34.29 47.17,34.11 47.17,25.29 45.13,23.25 U3.22 | U2.125 26.79,35.19 v27.69,34.29
  Bottom 0.254: v27.69,34.29 v27.69,34.3 29.27,35.88 41.99,35.88 43.58,34.29 v46.99,34.29
FSMC_NOE_OE  (via drill 0.41)
  Top 0.254: U3.11 45.73,28.75 46.35,29.38 46.35,32.38 v45.72,33.02 | U2.118 30.29,34.48 v30.48,34.29
  Bottom 0.254: v30.48,34.29 31.11,34.92 40.87,34.92 42.77,33.02 v45.72,33.02
FSMC_NWE_WE  (via drill 0.41)
  Top 0.254: U3.12 45.8,28.25 46.76,29.21 46.76,33.02 46.76,33.25 v46.35,33.66 | U2.119 29.79,34.87 v29.21,34.29
  Bottom 0.254: v29.21,34.29 30.35,35.43 41.4,35.43 43.18,33.66 v46.35,33.66
GND  (via drill 0.41, 0.51)  (33 unrouted)
  other vias: 99.11,41.18 99.11,25 1.24,41.81 1.24,8.82 7.62,18.34 3.58,18.86 2.16,37.72 2.54,30.99 44.48,32.08 44.45,27.48 42.24,27.48 38.81,28.42 37.97,10.92 29.08,13.08 34.29,12.57 39.24,13.34 34.29,10.79 25.02,36.83 35.56,33.02 16.89,36.83 22.91,30.35 19.3,32.49 22.86,25.04 31.27,25.15 32.84,30.35 39.73,23.42 39.5,21.59 35.28,21.84 34.01,17.78 19.46,16.1 17.4,16.1 17.27,18.9 14.61,15.21 17.32,13.06 11.46,13.06 9.3,15.24 4.45,14.99 23.8,16.48 27.56,10.13 34.82,6.88 49.02,15.49 50.42,29.08 50.55,22.1 48.26,10.29 54.1,9.02 16.64,26.21 8.49,1.08 91.67,1.08 98.66,8.06 91.67,48.7 50.02,48.83 8.23,48.79 18.9,45.74 23.62,37.72 29.97,40.13 25.65,39.75 32.77,40.13 41.66,45.72 49.78,39.12 54.99,42.55 61.72,13.21 55.75,15.75 89.79,18.67 89.92,14.99 35.81,40.13 37.82,26.47 50.83,33.73 37.85,33.15 47.9,33.6 38.73,40.13 29.72,36.83 54,32.84 26.67,34.29 22.73,41.27 26.29,45.85 51.56,44.45 60.2,37.08 58.42,29.97 55.63,29.97 58.8,20.83 58.55,15.75 19.81,19.46
  pour Top (isolate 0.203, rank 2): 0,50 100,50 100,0 0,0
  pour Bottom (isolate 0.203, rank 2): 0,50 100.12,50 arc-3 100.12,0 0,0
LAT0
  Top 0.254: U3.91 68.41,25.25 U5.2
LAT1
  Top 0.254: U3.90 67.14,24.75 67.28,24.61 U5.3
LAT2
  Top 0.254: U3.88 66.94,23.75 67.15,23.96 U5.4
LAT3
  Top 0.254: U3.87 67.22,23.25 67.28,23.31 U5.5
LAT4
  Top 0.254: U3.85 66.86,22.25 67.28,22.66 U5.6
LAT5
  Top 0.254: U3.84 67.14,21.75 67.4,22.01 U5.7
LAT6
  Top 0.254: U3.83 67.29,21.25 67.4,21.36 U5.8
LAT7
  Top 0.254: U3.82 68.38,20.75 U5.9
LD1  (via drill 0.41)
  Top 0.254: R14.2 54.92,47.03 v53.85,47.03 | U2.110 34.28,36.37 34.51,36.59 34.51,45.37 34.29,45.59 v34.29,45.64
  Bottom 0.254: v53.85,47.03 49.74,47.03 48.9,47.88 35.53,47.88 34.29,46.63 v34.29,45.64
MCU_ADC5  (1 unrouted)
  Top 0.254: R12.2 R11.2 | U2.37 17.27,14.26 15.79,14.26 14.67,13.14 14.67,12.26 14.02,11.61 7.23,11.61
MCU_ADC6  (2 unrouted)
MCU_AUX1  (via drill 0.41)
  Top 0.254: U3.137 48.84,34.74 v48.51,34.42 | U2.111 33.78,36.8 v33.76,36.83
  Bottom 0.254: v48.51,34.42 46.13,36.8 33.78,36.8 v33.76,36.83
MCU_AUX2  (via drill 0.41)
  Top 0.254: U3.136 49.34,34.51 v49.43,34.42 | U2.112 33.28,36.39 33.1,36.58 v33.1,37.39
  Bottom 0.254: v49.43,34.42 46.46,37.39 34.24,37.39 34.11,37.52 33.22,37.52 v33.1,37.39
MCU_AUX3  (via drill 0.41)
  Top 0.254: U3.135 49.84,35 v50.29,34.54 | U2.113 32.78,36.28 32.26,36.8 v32.26,36.88
  Bottom 0.254: v50.29,34.54 46.76,38.08 32.74,38.08 32.26,37.59 v32.26,36.88
MCU_AUX4  (via drill 0.41)
  Top 0.254: v49.28,36.71 49.88,36.71 50.34,36.24 U3.134 | U2.122 28.29,36.61 v28.07,36.83
  Bottom 0.254: v49.28,36.71 47.48,38.5 29.74,38.5 v28.07,36.83
MCU_AUX5  (via drill 0.41)
  Top 0.254: U2.139 19.79,36.41 v20.45,37.08 | v51.18,41.53 51.64,41.07 51.64,37.15 52.34,36.45 U3.130
  Bottom 0.254: v51.18,41.53 51.17,41.53 50.53,42.16 22.35,42.16 20.71,40.52 20.71,37.34 v20.45,37.08
MCU_AUX6  (via drill 0.41)
  Top 0.254: v51.82,42.27 v51.83,42.28 52.44,42.28 53.71,41.01 53.71,38.85 54.84,37.72 U3.125 | U2.140 19.29,37.18 v20.07,37.97
  Bottom 0.254: v51.82,42.27 51.51,42.57 21.49,42.57 20.2,41.28 20.2,38.1 v20.07,37.97
MCU_AUX7  (via drill 0.41)
  Top 0.254: U3.124 55.34,37.97 54.23,39.08 54.23,41.91 v53.72,42.42 | v19.57,38.73 18.79,37.95 U2.141
  Bottom 0.254: v53.72,42.42 53.11,43.03 20.99,43.03 19.69,41.73 19.69,38.86 v19.57,38.73
MCU_AUX8  (via drill 0.41)
  Top 0.254: U2.142 18.29,36.66 18.07,36.88 v18.07,37.59 | U3.122 56.34,42.67 55.58,43.43 v55.5,43.43
  Bottom 0.254: v18.07,37.59 18.07,38.35 18.07,40.68 20.82,43.43 55.24,43.43 v55.5,43.43
MCU_AUX9  (via drill 0.41)
  Top 0.254: U3.37 45.34,14.61 v44.58,14.61 | U2.53 25.29,17.4 25.4,17.52 25.4,18.41 v24.77,19.05
  Bottom 0.254: v24.77,19.05 30.23,19.05 31.11,18.16 31.11,15.88 32.89,14.1 35.56,14.1 | v44.58,14.61 44.45,14.61 43.94,14.1 38.78,14.1 35.56,14.1 | 35.56,14.1
MCU_AUX10  (via drill 0.41)
  Top 0.254: U3.38 45.84,14.99 45.59,15.24 v45.16,15.24 | U2.57 27.29,19.7 v26.92,20.07
  Bottom 0.254: v45.16,15.24 44.31,15.24 43.59,14.52 33.1,14.52 31.72,15.9 31.72,18.26 30.29,19.68 27.3,19.68 v26.92,20.07
MCU_AUX11  (via drill 0.41)
  Top 0.254: U3.39 46.34,15.29 v45.75,15.88 | U2.54 25.79,17.33 25.81,17.35 25.81,19.79 v24.51,21.08
  Bottom 0.254: v45.75,15.88 44.37,15.88 43.43,14.93 33.46,14.93 32.33,16.06 32.33,18.36 30.59,20.09 28.04,20.09 27.05,21.08 v24.51,21.08
MCU_AUX12  (via drill 0.41)
  Top 0.254: U3.41 47.34,15.4 v46.74,16 | v26.54,22.1 26.29,21.84 26.29,19.7 U2.55
  Bottom 0.254: v46.74,16 46.74,16.04 46.27,16.51 44.32,16.51 43.18,15.37 33.78,15.37 32.86,16.29 32.86,18.52 30.88,20.5 28.78,20.5 27.18,22.1 v26.54,22.1
MCU_INT0  (via drill 0.41, 0.51)
  Top 0.254: U2.1 24.23,33.75 v24.77,34.29 | U3.129 52.84,36.77 52.83,36.77 v52.83,36.93
  Bottom 0.254: v52.83,36.93 50.8,36.93 48.39,39.34 28.67,39.34 24.77,35.43 v24.77,34.29
MCU_INT1  (via drill 0.41)
  Top 0.254: U2.2 25,33.25 v25.65,33.91 | U3.49 51.34,16.54 v51.44,16.64
  Bottom 0.254: v25.65,33.91 25.65,35.75 28.82,38.91 48.13,38.91 53.34,33.7 53.34,29.84 51.44,27.94 v51.44,16.64
MCU_MCO  (via drill 0.41)
  Top 0.254: U2.100 38.49,29.75 40.15,28.09 41.29,28.09 v41.53,28.32 | v52.47,32.38 53.34,33.25 U3.128
  Bottom 0.254: v41.53,28.32 48.39,28.32 52.45,32.38 v52.47,32.38
MCU_VPU  (8 unrouted)
N$1  (via drill 0.41)
  other vias: 9.14,27.43 9.14,22.61
  pour Top (no thermals): 3.81,22.1 3.81,32.51 5.59,32.51 5.59,27.94 9.53,27.94 9.53,26.92 5.59,26.92 5.59,23.11 9.53,23.11 9.53,22.1 5.33,22.1
  pour Bottom (no thermals): 8.64,22.1 8.64,27.94 9.53,27.94 9.53,22.1
N$2
  Top 0.254: RN4.7 93.91,42.17 93.91,42.56 93.52,42.95 89.37,42.95 88.96,42.55 87.63,42.55 86.95,41.87 U8.1
N$3
  Top 0.254: RN4.8 92.64,42.55 89.53,42.55 88.9,41.91 U8.4
N$4  (via drill 0.41)
  Top 0.254: U8.8 91.21,46.35 v92.08,46.35 | v97.16,41.91 95.95,41.91 RN4.5
  Bottom 0.254: v92.08,46.35 92.08,43.81 93.98,41.91 v97.16,41.91
N$5
  Top 0.254: RN4.6 94.71,42.17 94.71,42.56 92.19,45.09 89.53,45.09 88.9,45.72 U8.11
N$6  (via drill 0.41)
  Top 0.305: R14.1 v57.81,47 LED4.A
  Bottom 0.305: v57.81,47 LED4.A
N$7  (via drill 0.41)
  Top 0.305: R13.1 v22.7,47 LED1.A
  Bottom 0.305: LED1.A v22.7,47
N$8  (via drill 0.41)
  Top 0.254: U2.23 14.33,22.75 13.72,23.37 12.62,23.37 XTAL1.2 12.11,23.88 v10.67,23.88
  Bottom 0.254: C18.2 v10.67,23.88
N$9  (via drill 0.41)
  Top 0.254: U2.24 14.38,22.25 12.19,20.07 XTAL1.1 11.86,19.05 v10.67,19.05
  Bottom 0.254: C16.2 11.8,19.05 v10.67,19.05
N$11  (via drill 0.51)
  Top 0.406: Q1.6 18.36,43.42 R44.2 v18.41,42.29 | Q2.1 18.35,39.18 v18.41,39.24
  Bottom 0.406: v18.41,39.24 v18.41,42.29
N$12  (3 unrouted)
N$13  (via drill 0.41)
  Top 0.305: LED8.A v42.51,47 R18.1
  Bottom 0.305: v42.51,47 LED8.A
N$15  (1 unrouted)
N$18  (via drill 0.41)
  Top 0.305: R17.1 v77.62,47 LED6.A
  Bottom 0.305: LED6.A v77.62,47
N$25  (2 unrouted)
N$26  (4 unrouted)
N$27
  Top 0.406: R43.2 14.14,45.68 14.59,45.22 Q1.3 Q1.2 Q1.1
N$31  (2 unrouted)
N$32
  Top 0.254: U7.3 53.91,2.81 D1.A 57.25,2.81 R50.2
N$33
  Top 0.254: U9.1 86.95,4.4 88.27,5.71 93.2,5.71 95.02,7.53 RN3.3
N$42  (via drill 0.41)
  Top 0.254: RN3.4 96.86,7.92 v97.16,7.62 | v88.9,5.08 U9.4
  Bottom 0.254: v97.16,7.62 91.44,7.62 v88.9,5.08
N$44
  Top 0.254: U9.8 92.24,9.25 93.32,8.17 RN3.1
N$45
  Top 0.254: U9.11 88.9,8.26 90.09,7.06 93.75,7.06 94.22,7.53 RN3.2
N$61  (1 unrouted)
N$64
  Top 0.254: U7.4 53.91,5.37 52.01,3.46 U7.1 50.66,3.15 R51.1
N$65
  Top 0.254: R51.2 48.47,2.96 R9.1
PWM
  Top 0.254: U2.96 39.11,27.75 39.77,27.09 39.77,24.68 40.7,23.75 U3.21
RST  (via drill 0.41)
  Top 0.254: U2.25 16.35,21.75 v16.51,21.59 | R5.1 16.11,12.12 v16.11,13.08
  Bottom 0.254: v16.51,21.59 16.51,15.01 16.11,14.61 v16.11,13.08
SRAM0_CLOCK
  Top 0.254: 46.84,37.52 46.89,37.56 | 46.89,37.56 47.05,37.72 47.05,41.29 47.62,41.87 IC1.6 | U3.141 46.84,37.52 | 46.84,37.52 46.89,37.56
SRAM0_CS
  Top 0.254: U3.144 45.34,37.48 45.11,37.71 45.11,39.28 | 45.11,39.28 IC1.1 45.11,39.28
SRAM0_SIO0
  Top 0.254: U3.138 48.34,37.9 48.32,37.92 48.32,41.16 48.66,41.51 48.9,41.74 IC1.5
SRAM0_SIO1
  Top 0.254: U3.142 46.34,38.73 | 46.34,38.73 46.34,39.29 | IC1.2 46.34,39.29 | 46.34,39.29 46.34,38.73
SRAM0_SIO2
  Top 0.254: U3.139 47.84,37.39 47.69,37.53 47.62,37.6 IC1.3
SRAM0_SIO3
  Top 0.254: U3.143 45.84,37.83 45.78,37.89 45.78,41.34 46.35,41.91 IC1.7
SRAM1_CLOCK
  Top 0.254: U3.118 58.34,37.55 58.98,38.2 58.98,41.64 59.63,42.29 59.63,44.57 IC2.6
SRAM1_CS
  Top 0.254: U3.121 56.84,38.42 57.02,38.61 IC2.1
SRAM1_SIO0
  Top 0.254: U3.116 59.34,37.13 60.25,38.05 60.25,41.53 61.02,42.29 61.02,44.45 IC2.5
SRAM1_SIO1
  Top 0.254: U3.119 57.84,37.76 58.29,38.21 IC2.2
SRAM1_SIO2
  Top 0.254: IC2.3 59.56,38.11 58.84,37.39 U3.117
SRAM1_SIO3
  Top 0.254: U3.120 57.34,37.96 57.7,38.31 57.7,41.75 58.36,42.42 58.36,44.57 IC2.7
SWCLK
  Top 0.254: J2.4 35.56,45.09 34.91,44.44 34.91,36.26 34.78,36.13 U2.109
SWDIO
  Top 0.254: J2.3 34.12,47.45 36.27,47.45 36.66,47.06 36.66,40.18 37.13,39.71 37.13,36.75 38.71,35.16 38.71,33.11 37.85,32.25 U2.105
USB_D+  (via drill 0.41)
  Top 0.254: v18.46,31.97 18.68,31.75 34.7,31.75 U2.104 | R3.1 12.83,30.87 13.88,31.93 v13.97,31.93
  Bottom 0.254: v13.97,31.93 14.02,31.98 16.51,31.98 v18.46,31.98 v18.46,31.97
USB_D-  (via drill 0.41)
  Top 0.254: v17.78,31.29 17.82,31.25 34.78,31.25 U2.103 | v11.94,31.16 11.94,30.62 R2.1
  Bottom 0.254: v11.94,31.16 17.65,31.16 v17.78,31.29
USB_DET  (via drill 0.41)
  Top 0.254: v14.1,29.46 14.1,31.06 14.79,31.75 U2.5
  Bottom 0.254: v14.1,29.46 R1.2
USBLED
  Top 0.254: R18.2 45.35,47.99 44.9,48.44 30.03,48.44 29.21,47.62 29.21,45.09 30.79,43.51 U2.117
VREF/VOUT  (23 unrouted)
  Top 0.254: IC20.6 83.82,6.49 C58.2 | IC22.6 75.31,6.49 C60.2 | IC18.6 75.31,15.13 C56.2 | IC11.6 83.82,15.13 C48.2
  Top 0.406: Q1.5 16,42.18 Q2.2
  Bottom 0.305: 86.29,45.11 90.81,40.59
  Bottom 0.457: 90.81,40.59 90.81,11.05 | 86.29,45.11 75.18,45.11 75.18,44.83
VREG_DAC  (1 unrouted)
VREGEN  (3 unrouted)
  Top 0.254: R17.2 67.32,47 64.39,44.07
VUSB  (via drill 0.41, 0.51)  (10 unrouted)
  Top 0.254: R11.1 v6.99,14.61 | C51.1 50.51,5.71 | 50.51,5.71 C14.1 | U7.5 51.98,5.71 50.51,5.71
  Bottom 0.254: v41.15,8.38 41.27,8.26
  Bottom 1.219: 8.76,8.26 8,8.26 6.99,9.27 v6.99,14.61 | 8.76,8.26 41.27,8.26 | 5.97,35.56 v5.97,35.73 5.71,35.73 5.71,39.5 10.71,44.5 v39.37,44.5 | v4.7,42.04 v3.68,42.04 0.89,39.24 0.89,8.26 8.76,8.26
  other vias: 38.1,44.5 40.26,8.13
  pour Bottom: 5.71,36.37 8.26,36.37 8.26,10.59 5.71,10.59
  pour Top: 6.6,35.81 6.6,38.35 3.81,38.35 3.81,33.27 8.64,33.27 8.64,35.81
  pour Top (no thermals): 37.47,45.13 40.01,45.13 40.01,41.45 37.47,41.45
  pour Top (no thermals): 41.53,12.88 39.88,12.88 39.88,7.67 41.53,7.67

## Text on the board
tPlace: PWR | USB | MODE | VREG | Ian Lesnet | I+S 2019 | SMDPRUTSER | v.trocio | MAY 2019 | Bus Pirate Ultra v1.0a
bPlace: PWR | USB | MODE | VREG | GND | +5V | 3V3 | VPU | ADC/DAC | Bus Pirate Ultra v1.0a | http://dangerousprototypes.com | https://smdprutser.nl | AUX | CS | MAY 2019 | MISO | CLK | MOSI | Fulfillment by | Seeed Studio | www.seeedstudio.com
tNames: 3.3V | GND | SW- / DIO | SW- / CLK
tValues: vimark
Reference: GND | +5v | +3v3 | Vpu | USB | ADC/DAC | I/O header | AUX0 | CS | MISO | CLK | MOSI | BUS PIRATE Ultra | Ian Lesnet MAY 2019 | http://dangerousprototypes.com | CC-0